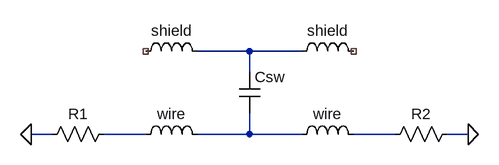
[diagram p0: schematic sch_A.asc]
sch_A.asc, the LTspice schematic file:
Version 4
SHEET 1 880 680
WIRE 0 32 -80 32
WIRE 80 32 0 32
WIRE 0 64 0 32
WIRE -304 160 -336 160
WIRE -160 160 -224 160
WIRE 0 160 0 128
WIRE 0 160 -80 160
WIRE 80 160 0 160
WIRE 224 160 160 160
WIRE 336 160 304 160
FLAG -336 160 0
FLAG 336 160 0
SYMBOL cap -16 64 R0
SYMATTR InstName Csw
SYMATTR Value ""
SYMBOL ind -176 48 R270
WINDOW 0 32 56 VTop 2
WINDOW 3 5 56 VBottom 2
SYMATTR InstName shield
SYMATTR Value ""
SYMBOL res -208 144 R90
WINDOW 0 0 56 VBottom 2
WINDOW 3 32 56 VTop 2
SYMATTR InstName R1
SYMATTR Value ""
SYMBOL ind 64 48 R270
WINDOW 0 32 56 VTop 2
WINDOW 3 5 56 VBottom 2
SYMATTR InstName shield
SYMATTR Value ""
SYMBOL ind -176 176 R270
WINDOW 0 32 56 VTop 2
WINDOW 3 5 56 VBottom 2
SYMATTR InstName wire
SYMATTR Value ""
SYMBOL ind 64 176 R270
WINDOW 0 32 56 VTop 2
WINDOW 3 5 56 VBottom 2
SYMATTR InstName wire
SYMATTR Value ""
SYMBOL res 320 144 R90
WINDOW 0 0 56 VBottom 2
WINDOW 3 32 56 VTop 2
SYMATTR InstName R2
SYMATTR Value ""

The netlist it stands for:
* sch_A.asc
Csw N001 N003
L§shield NC_01 N001
R1 N002 0
L§shield N001 NC_02
L§wire N002 N003
L§wire N003 N004
R2 0 N004
.backanno
.end